# Altium schematic sheet ALU_XOR.SchDoc
size A; Author: E. Sims; Organization: Let's Build Rockets Inc.; SheetNumber: 4; SheetTotal: 7
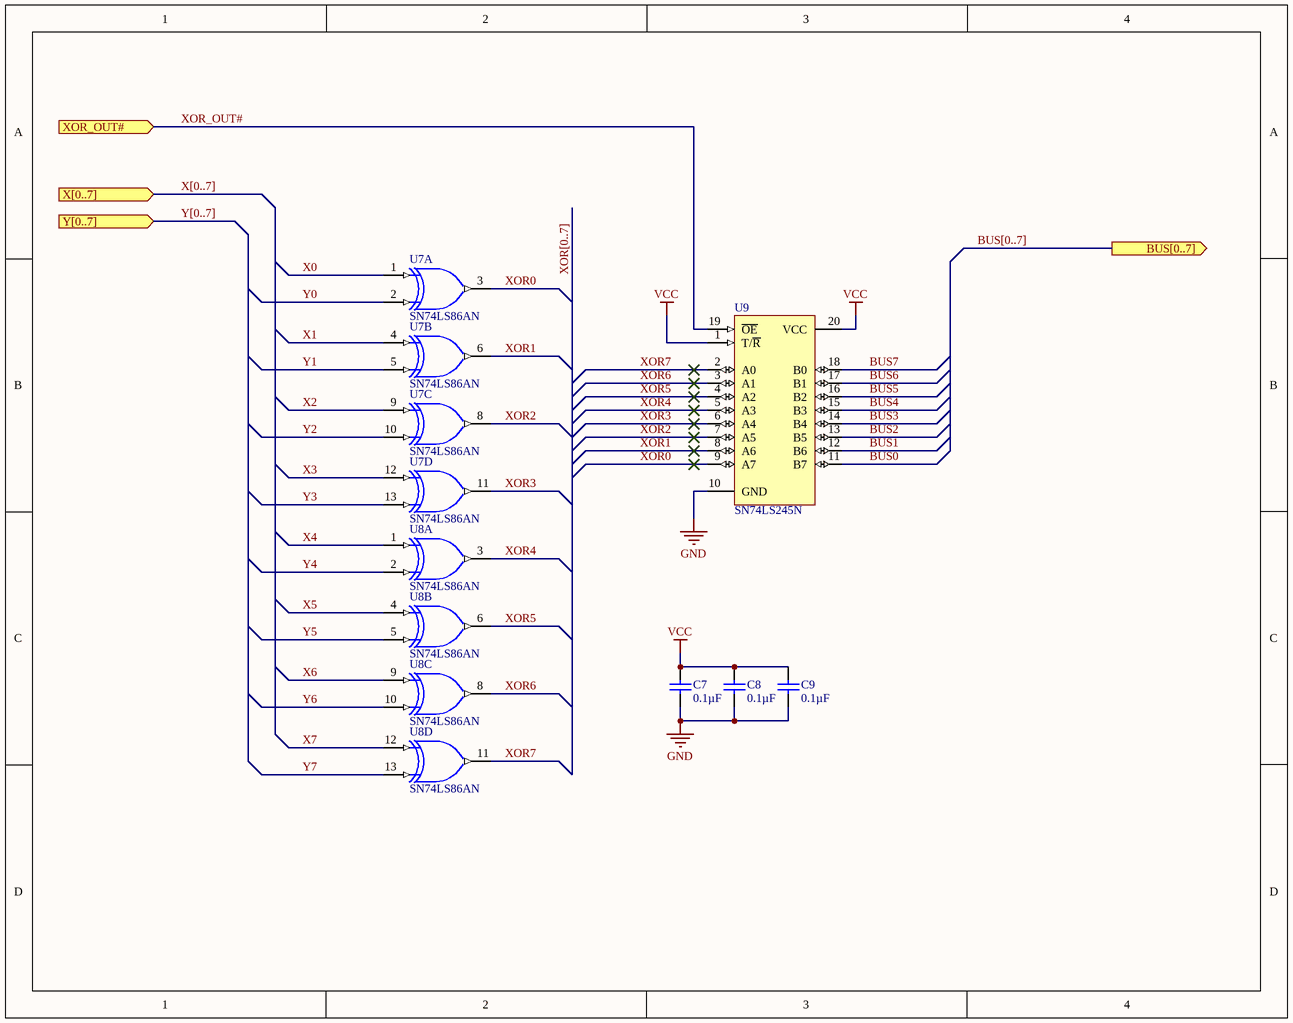
[diagram p0: ALU_XOR.SchDoc]

## Parts
C7  Capacitance: 0.1µF  [VISH-K104K15X7RF5TL2]  (hidden comment: K104K15X7RF5TL2)
C8  Capacitance: 0.1µF  [VISH-K104K15X7RF5TL2]  (hidden comment: K104K15X7RF5TL2)
C9  Capacitance: 0.1µF  [VISH-K104K15X7RF5TL2]  (hidden comment: K104K15X7RF5TL2)
U7  SN74LS86AN  [N014]  (parts A,B,C,D of 4)
U8  SN74LS86AN  [N014]  (parts A,B,C,D of 4)
U9  SN74LS245N  [N020]

## Ports
BUS[0..7] (out), X[0..7] (in), XOR_OUT# (in), Y[0..7] (in)

## Nets
GND: C7.2 C8.2 C9.2 U7.7(GND) U8.7(GND) U9.10(GND)
VCC: C7.1 C8.1 C9.1 U7.14(VCC) U8.14(VCC) U9.1(T/~{R}) U9.20(VCC)
BUS0: U9.11(B7)
BUS1: U9.12(B6)
BUS2: U9.13(B5)
BUS3: U9.14(B4)
BUS4: U9.15(B3)
BUS5: U9.16(B2)
BUS6: U9.17(B1)
BUS7: U9.18(B0)
X0: U7.1(A)
X1: U7.4(A)
X2: U7.9(A)
X3: U7.12(A)
X4: U8.1(A)
X5: U8.4(A)
X6: U8.9(A)
X7: U8.12(A)
XOR0: U7.3(Y) U9.9(A7)
XOR1: U7.6(Y) U9.8(A6)
XOR2: U7.8(Y) U9.7(A5)
XOR3: U7.11(Y) U9.6(A4)
XOR4: U8.3(Y) U9.5(A3)
XOR5: U8.6(Y) U9.4(A2)
XOR6: U8.8(Y) U9.3(A1)
XOR7: U8.11(Y) U9.2(A0)
XOR_OUT#: U9.19(~{OE}) ; port XOR_OUT#
Y0: U7.2(B)
Y1: U7.5(B)
Y2: U7.10(B)
Y3: U7.13(B)
Y4: U8.2(B)
Y5: U8.5(B)
Y6: U8.10(B)
Y7: U8.13(B)

## Buses and harness runs
bus BUS[0..7] = port BUS[0..7]
bus X[0..7] = port X[0..7]
bus XOR[0..7]
bus Y[0..7] = port Y[0..7]

## Notes on the sheet
- Let's Build Rocket's Inc. Modular Paylaod System Based on TMP-010 Rev
  For more information visit https://github.com/LetsBuildRockets/Modular-Payload-System
  This work is licensed under CC BY-NC 4.0. To view a copy of this license, visit https://creativecommons.org/licenses/by-nc/4.0
- Title
- Size:
- Date:
- Assembly Variant:
- B
- Number:
- Time:
- Revision:
- Sheet
- of
- Author:
- File:

## Library data of the parts
C7-C9 = CMP-2000-06508-1: Ceramic Capacitor, 100 nF, +/- 10%, 50 V, -55 to 125 degC, 2-Pin THD, RoHS, Tape and Reel; Manufacturer: Vishay; Other Names: BC1084CT; Catalog Drawings: Mono-KapSide2-15_5.58Mono-KapSide1_15; Temperature Coefficient: X7R; Voltage - Rated: 50V; Online Catalog: Mono-Kap™Series; Size / Dimension: 0.157"Lx0.098"W(4.00mmx2.50mm); Operating Temperature: -55°C~125°C; Family: CeramicCapacitors; Manufacturer URL: http://www.vishay.com/; Standard Package: 1; Thickness (Max): -; Ratings: -; Datasheet Version: 08/2013; Package Description: 2-Pin Through Hole Device, Body 4 x 2.6 mm; Mounting Type: ThroughHole; Features: -; Lead Spacing: 0.098"(2.50mm); Tolerance: ±10%; Category: Capacitors; Mounting Technology: ThroughHole; Lead Style: Straight; Datasheet URL: http://www.vishay.com/docs/45171/kseries.pdf; Applications: GeneralPurpose; Package / Case: Radial; Height - Seated (Max): 0.220"(5.58mm); Package Reference: K104K15X7RF5TL2; Series: Mono-Kap™K; Packaging: CutTape(CT)
U7 U8 = SN74LS86AN: Quadruple 2-Input Exclusive-OR Gate; Published: 8-Jun-2000; LatestRevisionDate: 04-Mar-2005; LatestRevisionNote: Stylized 3D Model Added.; DatasheetVersion: Mar-1988; PackageVersion: Oct-1995; PackageReference: N014; Publisher: Altium Limited; PackageDescription: DIP; 14 Leads; Row Spacing 7.62 mm; Pitch 2.54 mm; ComponentLink1Description: Manufacturer Link; ComponentLink1URL: http://www.ti.com/; ComponentLink2Description: Datasheet; ComponentLink2URL: http://www-s.ti.com/sc/ds/sn74ls86a.pdf
U9 = SN74LS245N: Octal Bus Transceiver with 3-State Outputs; Published: 8-Jun-2000; LatestRevisionDate: 04-Mar-2005; LatestRevisionNote: Stylized 3D Model Added.; DatasheetVersion: Mar-1988; PackageVersion: Oct-1995; PackageReference: N020; Publisher: Altium Limited; PackageDescription: DIP; 20 Leads; Row Spacing 7.62 mm; Pitch 2.54 mm; ComponentLink1Description: Manufacturer Link; ComponentLink1URL: http://www.ti.com/; ComponentLink2Description: Datasheet; ComponentLink2URL: http://www-s.ti.com/sc/ds/sn74ls245.pdf